# EAGLE design BluetoothModulePCBv1 (EAGLE 8.0.2)
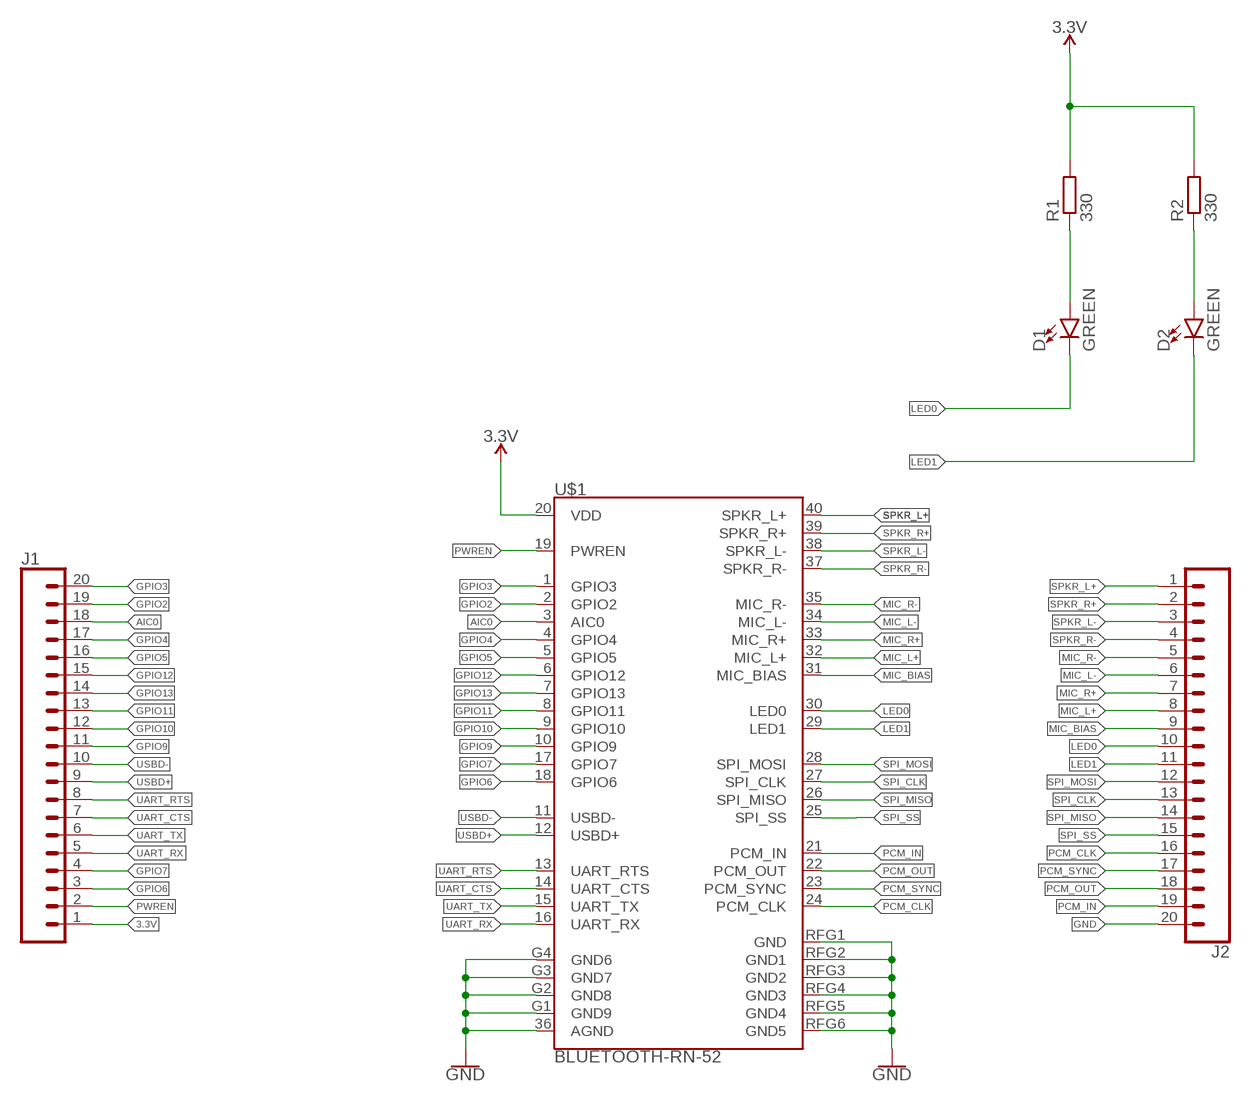
[diagram p0: schematic, sheet 1]

## Parts
D1  GREEN  LED3MM  [LED_3MM]
D2  GREEN  LED3MM  [LED_3MM]
J1  CONN_20  [1X20]
J2  CONN_20  [1X20]
R1  330  R-EU_0204/7  [0204/7]
R2  330  R-EU_0204/7  [0204/7]
U$1  BLUETOOTH-RN-52  [RN-52]

## Nets
3.3V: J1.1 R1.2 R2.2 U$1.20(VDD)
AIC0: J1.18 U$1.3(AIC0)
GND: J2.20 U$1.36(AGND) U$1.G1(GND9) U$1.G2(GND8) U$1.G3(GND7) U$1.G4(GND6) U$1.RFG1(GND) U$1.RFG2(GND1) U$1.RFG3(GND2) U$1.RFG4(GND3) U$1.RFG5(GND4) U$1.RFG6(GND5)
GPIO2: J1.19 U$1.2(GPIO2)
GPIO3: J1.20 U$1.1(GPIO3)
GPIO4: J1.17 U$1.4(GPIO4)
GPIO5: J1.16 U$1.5(GPIO5)
GPIO6: J1.3 U$1.18(GPIO6)
GPIO7: J1.4 U$1.17(GPIO7)
GPIO9: J1.11 U$1.10(GPIO9)
GPIO10: J1.12 U$1.9(GPIO10)
GPIO11: J1.13 U$1.8(GPIO11)
GPIO12: J1.15 U$1.6(GPIO12)
GPIO13: J1.14 U$1.7(GPIO13)
LED0: D1.K(C) J2.10 U$1.30(LED0)
LED1: D2.K(C) J2.11 U$1.29(LED1)
MIC_BIAS: J2.9 U$1.31(MIC_BIAS)
MIC_L+: J2.8 U$1.32(MIC_L+)
MIC_L-: J2.6 U$1.34(MIC_L-)
MIC_R+: J2.7 U$1.33(MIC_R+)
MIC_R-: J2.5 U$1.35(MIC_R-)
N$1: D1.A R1.1
N$2: D2.A R2.1
PCM_CLK: J2.16 U$1.24(PCM_CLK)
PCM_IN: J2.19 U$1.21(PCM_IN)
PCM_OUT: J2.18 U$1.22(PCM_OUT)
PCM_SYNC: J2.17 U$1.23(PCM_SYNC)
PWREN: J1.2 U$1.19(PWREN)
SPI_CLK: J2.13 U$1.27(SPI_CLK)
SPI_MISO: J2.14 U$1.26(SPI_MISO)
SPI_MOSI: J2.12 U$1.28(SPI_MOSI)
SPI_SS: J2.15 U$1.25(SPI_SS)
SPKR_L+: J2.1 U$1.40(SPKR_L+)
SPKR_L-: J2.3 U$1.38(SPKR_L-)
SPKR_R+: J2.2 U$1.39(SPKR_R+)
SPKR_R-: J2.4 U$1.37(SPKR_R-)
UART_CTS: J1.7 U$1.14(UART_CTS)
UART_RTS: J1.8 U$1.13(UART_RTS)
UART_RX: J1.5 U$1.16(UART_RX)
UART_TX: J1.6 U$1.15(UART_TX)
USBD+: J1.9 U$1.12(USBD+)
USBD-: J1.10 U$1.11(USBD-)

## Library data of the parts
D1 D2 = SparkFun-LED:LED: LED (Generic) Standard schematic elements and footprints for 5mm, 3mm, 1206, and 0603 sized LEDs. Generic LEDs with no color specified.; PROD_ID: DIO-08794
J1 J2 = SparkFun-Connectors:CONN_20: Multi connection point. Often used as Generic Header-pin footprint for 0.1 inch spaced/style header connections On any of the 0.1 inch spaced packages, you can populate with these: Break Away Headers - Straight <https://www.sparkfun.com/products/116> (PRT-00116) Break Away Male Headers - Right Angle <https://www.sparkfun.com/products/553> (PRT-00553) Female Headers <https://www.sparkfun.com/products/115> (PRT-00115) Break Away Headers - Machine Pin <https://www.sparkfun.com/products/117> (PRT-00117) Break Away Female Headers - Swiss Machine Pin <https://www.sparkfun.com/products/743> (PRT-00743) For SCREWTERMINALS and SPRING TERMINALS visit here: Screw Terimnals on SparkFun.com <https://www.sparkfun.com/search/results?term=Screw+Terminals> (5mm/3.5mm/2.54mm spacing) This device is also useful as a general connection point to wire up your design to another part of your project. Our various solder wires solder well into these plated through hole pads. Hook-Up Wire - Assortment (Stranded, 22 AWG) <https://www.sparkfun.com/products/11375> (PRT-11375) Hook-Up Wire - Assortment (Solid Core, 22 AWG) <https://www.sparkfun.com/products/11367> (PRT-11367) View the entire wire category on our website here <https://www.sparkfun.com/categories/141> Special notes: Molex polarized connector foot print use with SKU : PRT-08231 with associated crimp pins and housings. 1MM SMD Version SKU: PRT-10208 NOTES ON THE VARIANTS LOCK and LOCK_LONGPADS... This footprint was designed to help hold the alignment of a through-hole component (i.e. 6-pin header) while soldering it into place. You may notice that each hole has been shifted either up or down by 0.005 of an inch from it's more standard position (which is a perfectly straight line). This slight alteration caused the pins (the squares in the middle) to touch the edges of the holes. Because they are alternating, it causes a "brace" to hold the component in place. 0.005 has proven to be the perfect amount of "off-center" position when using our standard breakaway headers. Although looks a little odd when you look at the bare footprint, once you have a header in there, the alteration is very hard to notice. Also,if you push a header all the way into place, it is covered up entirely on the bottom side. Note about LOCK SPECIAL package: This is just like the LOCK variant in that the holes are staggared by 5 mil, but except for the last two holes. They are not altered from the "standard" footprint layout. This is used for a special purpose on the layout of our Graphic LCD Backpack. Make sure you want to use this device before selecting it for you project!
R1 R2 = resistor:R-EU_: RESISTOR, European symbol
U$1 = SparkFun-RF:BLUETOOTH-RN-52: Roving Networks RN-52 Bluetooth Audio Module The RN-52 is an audio module that provides a highly integrated solution for delivering high quality stereo audio in a small form factor with little difficulty. This module is perfect for a project involving hands free audio for your car, remote controlling your media center, or streaming 2-channel audio. SparkFun Products: RN-52 - Bluetooth Audio Module <https://www.sparkfun.com/products/11678> (WRL-11678) Audio Bluetooth Breakout - RN-52 <https://www.sparkfun.com/products/12849> (WRL-12849); PROD_ID: IC-11569; SF_ID: WRL-11678

## Board
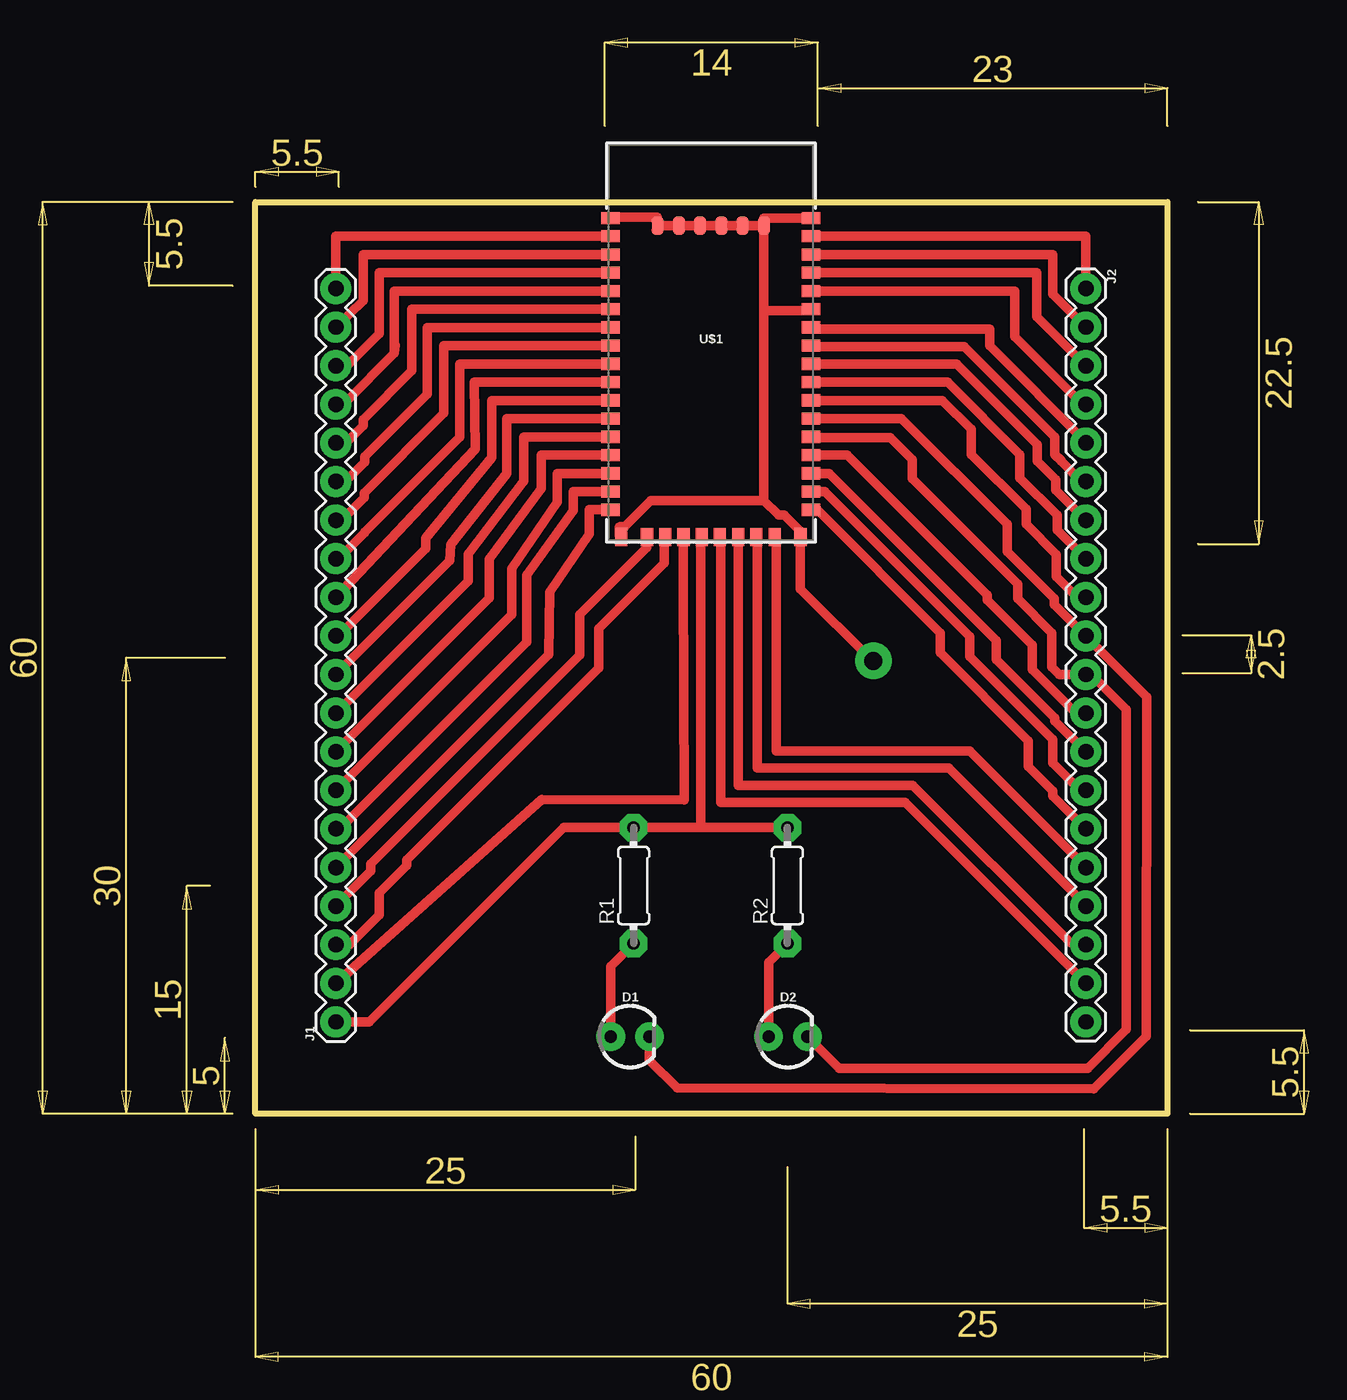
[diagram p1: board, top side]
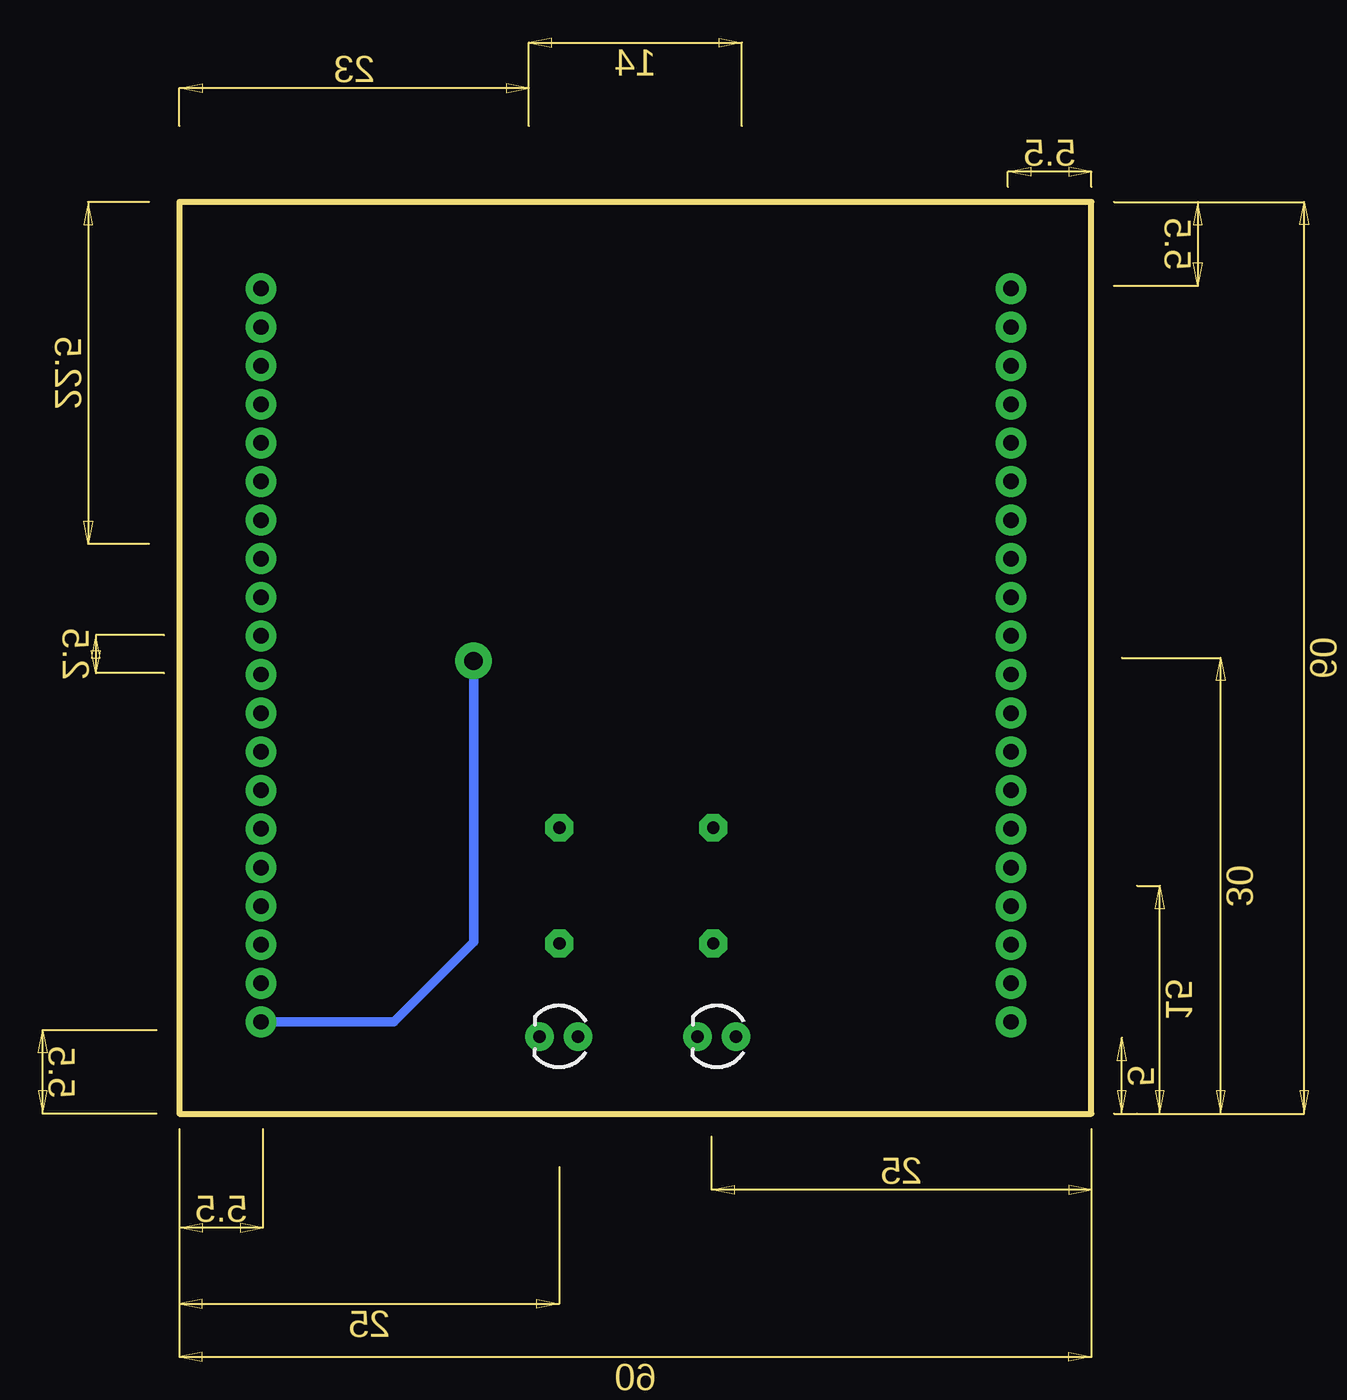
[diagram p2: board, bottom side, seen from below]

Size 60 x 60 mm. Coordinates in mm from the lower left corner, seen from the top.
Outline: 0,0 0,60 60,60 60,0 0,0
Copper layers (1*16): Top 0.035mm / dielectric 1.5mm / Bottom 0.035mm
Design rules "LabE": minimum track width 24mil, minimum drill 0.8mm, track to track 16mil, track to pad 16mil, pad to pad 16mil, via to via 16mil, smd to smd 16mil, copper to edge 0mil, drill to drill 16mil, minimum pad ring 20mil, minimum via ring 20mil, stop-mask expansion 4mil, vias tented up to drill 0mil, thermal gap 10mil

### Footprints (pad centres in the part's own frame; a part is rotated, then mirrored left to right if it is on the bottom)
LED_3MM = drill 0.813 pad 1.88: A -1.27,0; K 1.27,0
1X20 = drill 1.016 pad 1.88: 1 0,0; 2 2.54,0; 3 5.08,0; 4 7.62,0; 5 10.16,0; 6 12.7,0; 7 15.24,0; 8 17.78,0; 9 20.32,0; 10 22.86,0; 11 25.4,0; 12 27.94,0; 13 30.48,0; 14 33.02,0; 15 35.56,0; 16 38.1,0; 17 40.64,0; 18 43.18,0; 19 45.72,0; 20 48.26,0
0204/7 = drill 0.813 octagon: 1 -3.81,0; 2 3.81,0
RN-52 = smd 1.2 x 0.8: 1 -6.6,8.33; 2 -6.6,7.13; 3 -6.6,5.93; 4 -6.6,4.73; 5 -6.6,3.53; 6 -6.6,2.33; 7 -6.6,1.13; 8 -6.6,-0.07; 9 -6.6,-1.27; 10 -6.6,-2.47; 11 -6.6,-3.67; 12 -6.6,-4.87; 13 -6.6,-6.07; 14 -6.6,-7.27; 15 -6.6,-8.47; 16 -6.6,-9.67; 25 6.6,-9.67; 26 6.6,-8.47; 27 6.6,-7.27; 28 6.6,-6.07; 29 6.6,-4.87; 30 6.6,-3.67; 31 6.6,-2.47; 32 6.6,-1.27; 33 6.6,-0.07; 34 6.6,1.13; 35 6.6,2.33; 36 6.6,3.53; 37 6.6,4.73; 38 6.6,5.93; 39 6.6,7.13; 40 6.6,8.33; G1 -6.6,9.53; G4 6.6,9.53 | smd 0.8 x 1.2: 17 -4.2,-11.47; 18 -3,-11.47; 19 -1.8,-11.47; 20 -0.6,-11.47; 21 0.6,-11.47; 22 1.8,-11.47; 23 3,-11.47; 24 4.2,-11.47; G2 -5.9,-11.47; G3 5.9,-11.46; RFG1 -3.5,9.03; RFG2 -2.1,9.03; RFG3 -0.7,9.03; RFG4 0.7,9.03; RFG5 2.1,9.03; RFG6 3.5,9.03

### Placement (x,y rotation side)
D1  24.65,5.09 0 top
D2  35.04,5.09 0 top
J1  5.29,6.05 90 top
J2  54.63,54.31 270 top
R1  24.88,15.02 90 top
R2  35,15.02 90 top
U$1  29.96,49.42 0 top

### Tracks (layer width: path | path; a pad name or v marks a point on that pad's centre or on a via)
3.3V
  Top 0.406: 29.5,37.95 U$1.20
  Top 0.61: J1.1 7.5,6.05 20.3,18.85 24.86,18.85 R1.2 29.3,18.83 | 29.3,18.83 R2.2 | U$1.20 29.3,37.89 29.3,18.83
AIC0
  Top 0.61: U$1.3 8.15,55.35 8.15,51.35 6.03,49.23 J1.18
GND  (via drill 1.2)
  Top 0.61: U$1.G1 23.36,59 26.45,59 U$1.RFG1 U$1.RFG2 U$1.RFG3 U$1.RFG4 U$1.RFG5 U$1.RFG6 | U$1.RFG6 33.46,58.95 U$1.G4 | U$1.36 36.56,52.85 33.45,52.85 | 33.45,52.85 U$1.RFG6 | 33.45,40.37 33.45,52.85 | 33.45,40.37 26.02,40.37 24.3,38.65 24,38.65 23.95,38.6 23.95,38.06 U$1.G2 | 33.45,40.37 34.42,39.4 34.8,39.4 35.86,38.34 U$1.G3 35.86,34.54 40.6,29.8 v40.65,29.8
  Bottom 0.61: v40.65,29.8 40.65,11.3 45.9,6.05 J2.20
GPIO2
  Top 0.61: U$1.2 7.1,56.55 7.1,53.53 J1.19
GPIO3
  Top 0.61: U$1.1 5.29,57.75 J1.20
GPIO4
  Top 0.61: U$1.4 9.15,54.15 9.15,50.05 | 9.15,50.05 9.2,50.6 | 9.15,50.05 5.94,46.84 J1.17
GPIO5
  Top 0.61: U$1.5 10.3,52.95 10.3,48.9 7.1,45.7 7.1,45.3 5.95,44.15 J1.16
GPIO6
  Top 0.61: J1.3 6.18,11.13 8.15,13.1 8.15,14.55 9.95,16.35 9.95,16.7 22.6,29.35 22.6,31.95 26.9,36.25 26.9,37.89 U$1.18
GPIO7
  Top 0.61: U$1.17 25.76,37.26 21.35,32.85 21.35,30.2 7.6,16.45 7.6,15.98 J1.4
GPIO9
  Top 0.61: J1.11 5.45,31.45 11.2,37.2 11.2,37.9 15.55,43.2 15.55,46.95 U$1.10
GPIO10
  Top 0.61: U$1.9 14.4,48.15 14.45,43.75 J1.12
GPIO11
  Top 0.61: U$1.8 13.45,49.35 13.45,44.55 7.2,38.3 7.2,38.25 5.48,36.53 J1.13
GPIO12
  Top 0.61: U$1.6 11.3,51.75 11.3,47.35 7.2,43.25 7.2,42.9 5.91,41.61 J1.15
GPIO13
  Top 0.61: U$1.7 12.4,50.55 12.4,46.1 7.15,40.85 7.15,40.55 5.67,39.07 J1.14
LED0
  Top 0.61: D1.K 25.92,3.53 27.75,1.7 55.15,1.65 58.6,5.1 58.65,27.43 J2.10 52.55,33.53 52.55,33.9 49.45,37 49.45,38.8 42.5,45.75 U$1.30
LED1
  Top 0.61: D2.K 38.4,3 54.75,3 57.3,5.55 57.3,26.6 54.99,28.91 J2.11 52.89,28.91 52.4,29.4 52.4,31.65 50.15,33.9 50.15,34.85 43.2,41.8 43.2,43.05 41.75,44.5 36.61,44.5 U$1.29
MIC_BIAS
  Top 0.61: J2.9 54.06,33.99 52.7,35.35 52.7,36.8 50.7,38.8 50.7,39.8 47.1,43.4 47.1,45.05 45.2,46.95 U$1.31
MIC_L+
  Top 0.61: U$1.32 45.55,48.15 50.3,43.4 50.3,41.85 52.75,39.4 52.75,38.41 J2.8
MIC_L-
  Top 0.61: J2.6 54.34,41.61 53,42.95 53,43 52.6,43.4 52.6,44.55 46.65,50.5 36.61,50.5 U$1.34
MIC_R+
  Top 0.61: U$1.33 46.15,49.35 51.45,44.05 51.45,42.95 52.65,41.75 52.65,41.05 J2.7
MIC_R-
  Top 0.61: U$1.35 36.56,51.65 48.3,51.65 48.3,50.55 54.63,44.22 J2.5
N$1
  Top 0.61: R1.1 23.38,9.71 D1.A
N$2
  Top 0.61: R2.1 33.77,9.98 D2.A
PCM_CLK
  Top 0.61: U$1.24 34.25,37.88 34.25,23.88 47,23.88 54.62,16.25 J2.16
PCM_IN
  Top 0.61: U$1.21 30.62,37.88 30.62,20.5 42.75,20.5 54.62,8.62 J2.19
PCM_OUT
  Top 0.61: U$1.22 31.75,37.88 31.75,21.62 43.25,21.62 53.62,11.25 54.62,11.25 J2.18
PCM_SYNC
  Top 0.61: U$1.23 33,37.88 33,22.75 45.62,22.75 54.62,13.75 J2.17
PWREN
  Top 0.61: U$1.19 28.16,35.16 28.2,20.65 18.85,20.7 J1.2
SPI_CLK
  Top 0.61: U$1.27 37.75,42.15 48.75,31.15 48.75,29.9 52.6,26.05 52.6,25.86 J2.13
SPI_MISO
  Top 0.61: J2.14 54.26,21.29 52.45,23.1 52.45,24.65 47,30.1 47,31.4 37.45,40.95 U$1.26
SPI_MOSI
  Top 0.61: U$1.28 38.95,43.35 48.15,34.15 48.15,33.8 51.1,30.85 51.1,29.25 54.1,26.25 54.51,26.25 J2.12
SPI_SS
  Top 0.61: U$1.25 36.95,39.75 45.05,31.65 45.05,30.35 50.85,24.55 50.85,22.85 52.45,21.25 52.45,20.93 J2.15
SPKR_L+
  Top 0.61: U$1.40 54.63,57.75 J2.1
SPKR_L-
  Top 0.61: U$1.38 51.4,55.35 51.4,52.46 J2.3
SPKR_R+
  Top 0.61: U$1.39 52.45,56.55 52.45,53.95 J2.2
SPKR_R-
  Top 0.61: J2.4 54.41,46.69 49.95,51.15 49.95,54.15 U$1.37
UART_CTS
  Top 0.61: U$1.14 19.85,42.15 19.85,40.25 16.85,35.9 16.85,32.85 J1.7
UART_RTS
  Top 0.61: J1.8 15.4,33.95 15.4,36.5 18.8,41.15 18.8,43.35 U$1.13
UART_RX
  Top 0.61: U$1.16 21.95,39.75 21.95,38.15 19.35,34.35 19.3,30.22 J1.5
UART_TX
  Top 0.61: J1.6 5.55,18.75 17.85,31.05 17.85,35.45 20.9,39.7 20.9,40.95 U$1.15
USBD+
  Top 0.61: J1.9 5.32,26.37 14,35.05 14,36.85 17.65,41.65 17.65,44.55 U$1.12
USBD-
  Top 0.61: U$1.11 16.55,45.75 16.55,42.15 12.85,37.45 12.8,36.42 J1.10